# Altium schematic sheet CAN.SchDoc
size A; SheetNumber: 2; SheetTotal: 5
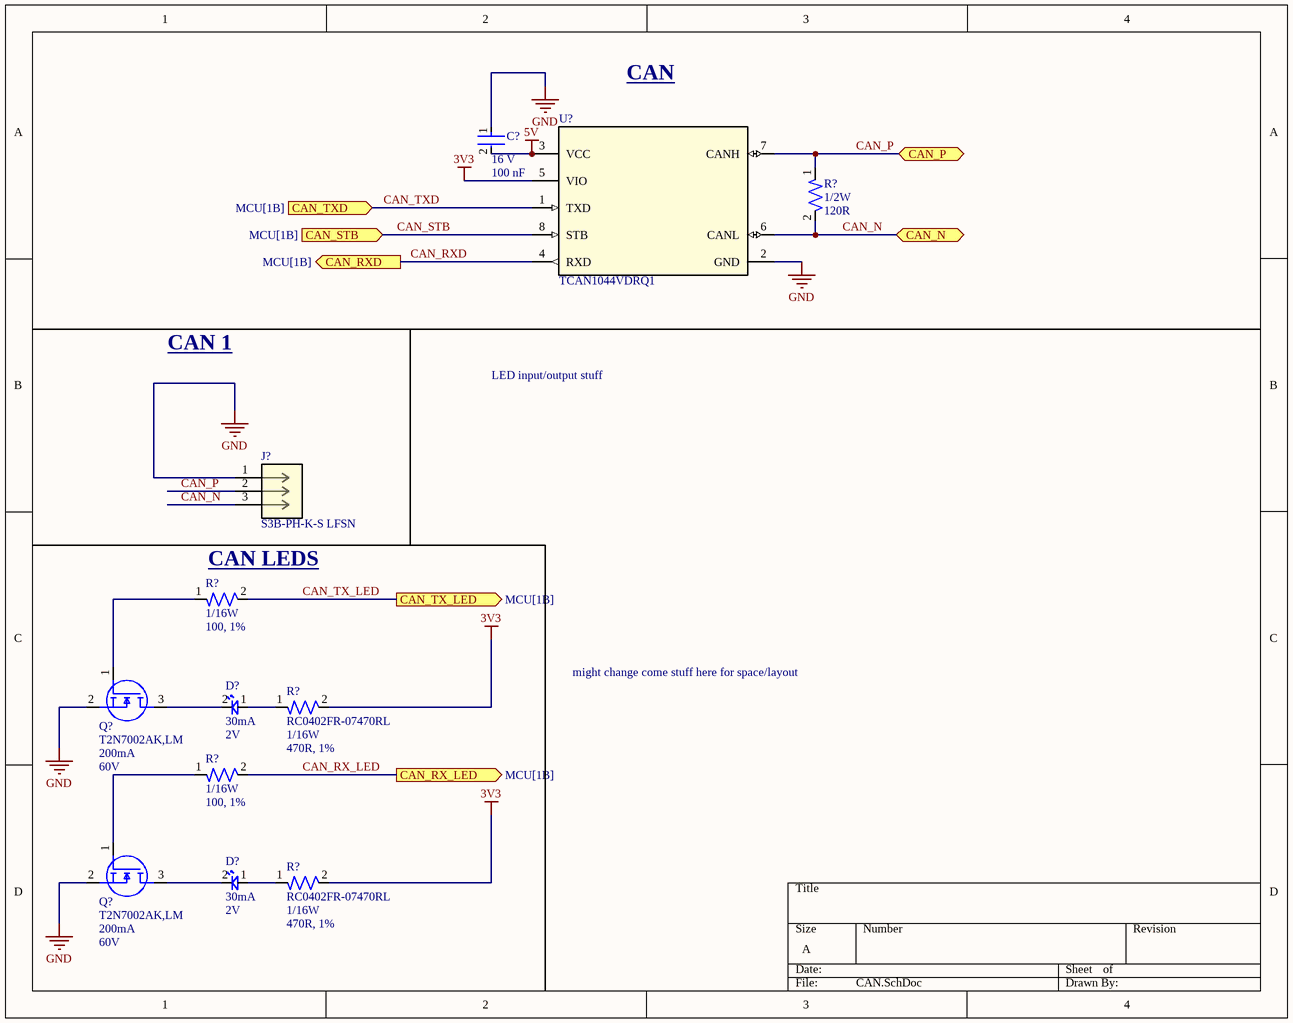
[diagram p0: CAN.SchDoc]

## Parts
(Parts that share a designator on the sheet are numbered #1, #2 ... from top to bottom, then left to right.)
C?  Voltage Rating: 16 V  Capacitance: 100 nF  [CAP-0402]  (hidden comment: CC0402KRX7R7BB104)
D?#1  Current Rating: 30mA  Vf: 2V  [LED0603-R-RD]  (hidden comment: BL-HKC36G-AV-TRB)
D?#2  Current Rating: 30mA  Vf: 2V  [LED0603-R-RD]  (hidden comment: BL-HKC36G-AV-TRB)
J?  S3B-PH-K-S LFSN  [CONN-3POS-JST]
Q?#1  T2N7002AK,LM  Id-Continuous: 200mA  VDS-Max: 60V  [NMOS-SOT23-3]
Q?#2  T2N7002AK,LM  Id-Continuous: 200mA  VDS-Max: 60V  [NMOS-SOT23-3]
R?#1  Power: 1/2W  Resistance: 120R  [RES-1210]  (hidden comment: RC1210FR-07120RL)
R?#2  Power: 1/16W  Resistance: 100, 1%  [RESC1005X40X25NL05T10]  (hidden comment: RC0402FR-07100RL)
R?#3  RC0402FR-07470RL  Power: 1/16W  Resistance: 470R, 1%  [RESC1005X40X25NL05T10]
R?#4  Power: 1/16W  Resistance: 100, 1%  [RESC1005X40X25NL05T10]  (hidden comment: RC0402FR-07100RL)
R?#5  RC0402FR-07470RL  Power: 1/16W  Resistance: 470R, 1%  [RESC1005X40X25NL05T10]
U?  TCAN1044VDRQ1  [IC-8SOIC]

## Ports
CAN_N (bidir), CAN_P (bidir), CAN_RX_LED (out, see MCU[1B]), CAN_RXD (out, see MCU[1B]), CAN_STB (in, see MCU[1B]), CAN_TX_LED (out, see MCU[1B]), CAN_TXD (in, see MCU[1B])

## Nets
3V3: R?#3.2 R?#5.2 U?.5(VIO)
5V: C?.2 U?.3(VCC)
GND: C?.1 J?.1 Q?#1.2(S) Q?#2.2(S) U?.2(GND)
CAN_N: J?.3 R?#1.2 U?.6(CANL) ; port CAN_N
CAN_P: J?.2 R?#1.1 U?.7(CANH) ; port CAN_P
CAN_RX_LED: R?#4.2 ; port CAN_RX_LED
CAN_RXD: U?.4(RXD) ; port CAN_RXD
CAN_STB: U?.8(STB) ; port CAN_STB
CAN_TX_LED: R?#2.2 ; port CAN_TX_LED
CAN_TXD: U?.1(TXD) ; port CAN_TXD
NetD?#1_1: D?#1.1 R?#3.1
NetD?#1_2: D?#1.2 Q?#1.3(D)
NetD?#2_1: D?#2.1 R?#5.1
NetD?#2_2: D?#2.2 Q?#2.3(D)
NetQ?#1_1: Q?#1.1(G) R?#2.1
NetQ?#2_1: Q?#2.1(G) R?#4.1

## Notes on the sheet
- CAN
- CAN 1
- LED input/output stuff
- CAN LEDS
- might change come stuff here for space/layout

## Library data of the parts
C? = CAP-0.1U-0001: CAP CER 0.1UF 16V X7R 0402; ComponentLink2Description: Datasheet; ComponentLink2URL: https://www.yageo.com/upload/media/product/productsearch/datasheet/mlcc/UPY-GPHC_X7R_6.3V-to-250V_24.pdf; Device Class: Ceramic; Size: 0402
D?#1 D?#2 = LED-0001: LED YELLOW CLEAR 0603 SMD
J? = CONN-3POS-JST: CONN HEADER R/A 3POS 2MM; Mfr_Name: JST; Digi-Key_Part_Number_1: 455-1720-ND; RefDes: RefDes; Type: Type
Q?#1 Q?#2 = NMOS-200MA-0001: MOSFET N-CH 60V 200MA SOT23; Manufacturer: Toshiba; FET type: N-Channel; Rds On-Max: 3.9Ohm; Vgs-Max: 20V; Assembled?: no; Manufacturer Part Number: T2N7002AK,LM; Package: SOT-23-3
R?#1 = RES-120-0001: RES 120 OHM 1% 1/2W 1210; Tolerance: 1%; Size: 1210; ComponentLink1Description: Datasheet; ComponentLink1URL: https://www.yageo.com/upload/media/product/products/datasheet/rchip/PYu-RC_Group_51_RoHS_L_12.pdf
R?#2 R?#4 = RES-100-0001: RES 100 OHM 1% 1/16W 0402; Max Power Dissipation: 63mW; Voltage Rating (DC): 50V; Temperature Coefficient: 100ppm/°C; Power Rating: 62.5mW; Technology: THICK FILM; Size Code: 0402; Series: RC; Length: 1mm; Case/Package: 0402; Features: Moisture Resistant; Termination: SMD/SMT; Case Code (Metric): 1005; Reach SVHC Compliant: Yes; Number of Terminations: 2; Tolerance: 1%; Lead Free: Lead Free; Military Standard: Not; Resistor Type: Thick Film; Max Operating Temperature: 155°C; RoHS Compliant: Yes; Construction: Rectangular; Voltage Rating: 50V; Packaging: Tape and Reel; Height: 0.32mm; Number of Pins: 2; Resistance Tolerance: 1%; Case Code (Imperial): 0402; Depth: 0.5mm; Min Operating Temperature: -55°C; Width: 0.5mm
R?#3 R?#5 = RES-470-0001: 470 Ohms ±1% 0.063W, 1/16W Chip Resistor 0402 (1005 Metric) Moisture Resistant Thick Film; Manufacturer: Yageo / Phycomp; Part Number: RC0402FR-07470RL
U? = IC-CAN-0001: IC TRANSCEIVER 1/1 8SOIC; ComponentLink1Description: Datasheet; ComponentLink1URL: https://www.ti.com/lit/ds/symlink/tcan1044-q1.pdf?HQS=dis-dk-null-digikeymode-dsf-pf-null-wwe&ts=1728758303289&ref_url=https%253A%252F%252Fwww.ti.com%252Fgeneral%252Fdocs%252Fsuppproductinfo.tsp%253FdistId%253D10%2526gotoUrl%253Dhttps%253A%252F%252Fwww.ti.com%252Flit%252Fgpn%252Ftcan1044-q1